# EAGLE design ATEM Tally Shield v1.0 (EAGLE 6.2)
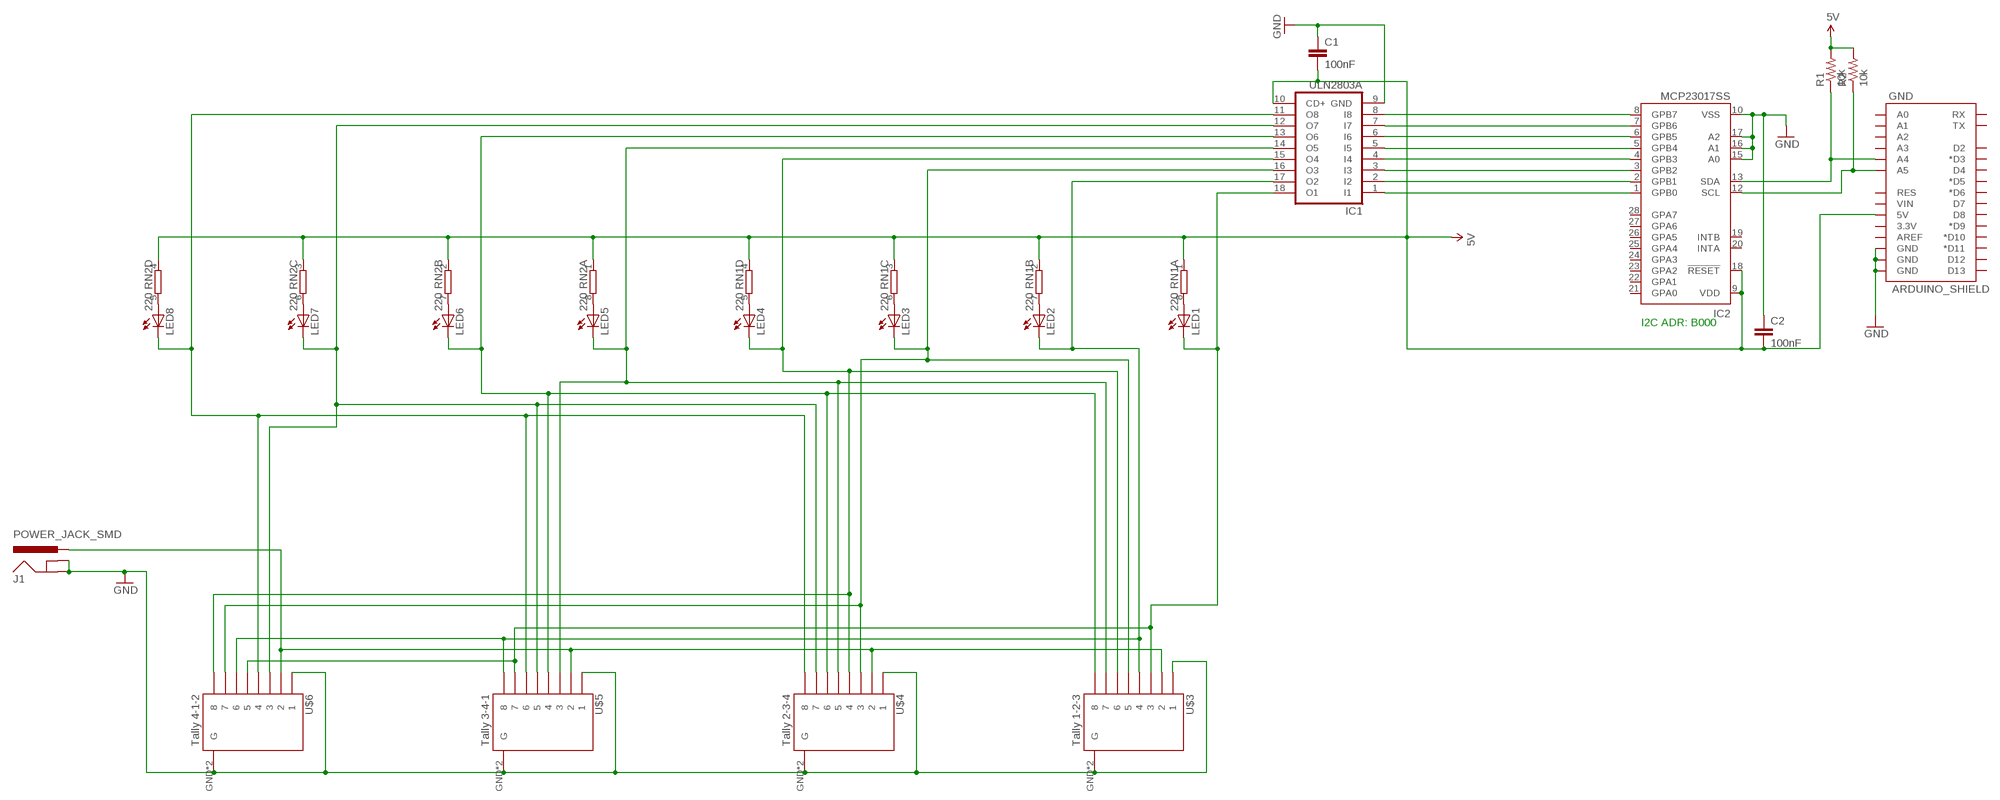
[diagram p0: schematic, sheet 1]

## Parts
C1  100nF  CAP0805  [0805]
C2  100nF  CAP0603-CAP  [0603-CAP]
GND  ARDUINO_SHIELD  [ARDUINO_BOXSHIELD_NOHOLES]
IC1  ULN2803A  ULN2803ASO18W  [SO18W]
IC2  MCP23017SS  [SSOP28]
J1  POWER_JACK_SMD  [POWER_JACK_SMD]
LED1  LEDSML0805  [SML0805]
LED2  LEDSML0805  [SML0805]
LED3  LEDSML0805  [SML0805]
LED4  LEDSML0805  [SML0805]
LED5  LEDSML0805  [SML0805]
LED6  LEDSML0805  [SML0805]
LED7  LEDSML0805  [SML0805]
LED8  LEDSML0805  [SML0805]
R1  10k  RESISTOR0603-RES  [0603-RES]
R2  10k  RESISTOR0603-RES  [0603-RES]
RN1  220  4R-NCAY16  [CAY16_HAND]
RN2  220  4R-NCAY16  [CAY16_HAND]
U$3  Tally 1-2-3  RJ45-8_GND  [RJ45-8_GND]
U$4  Tally 2-3-4  RJ45-8_GND  [RJ45-8_GND]
U$5  Tally 3-4-1  RJ45-8_GND  [RJ45-8_GND]
U$6  Tally 4-1-2  RJ45-8_GND  [RJ45-8_GND]

## Nets
5V [PWR]: C1.2 C2.2 GND.5V@0(5V) IC1.10(CD+) IC2.9(VDD) IC2.18(!RESET) R1.2 R2.2 RN1.1 RN1.2 RN1.3 RN1.4 RN2.1 RN2.2 RN2.3 RN2.4
GND [PWR]: C1.1 C2.1 GND.GND@0(GND) GND.GND@1(GND) GND.GND@4(GND) IC1.9(GND) IC2.10(VSS) IC2.15(A0) IC2.16(A1) IC2.17(A2) J1.GND J1.SHUNT(GNDBREAK) U$3.1 U$3.GND1(G) U$3.GND(G) U$4.1 U$4.GND1(G) U$4.GND(G) U$5.1 U$5.GND1(G) U$5.GND(G) U$6.1 U$6.GND1(G) U$6.GND(G)
N$2: IC1.18(O1) LED1.C U$3.3 U$5.7 U$6.5
N$4: J1.PWR U$3.2 U$4.2 U$5.2 U$6.2
N$5: IC1.1(I1) IC2.1(GPB0)
N$6: IC1.17(O2) LED2.C U$3.4 U$5.8 U$6.6
N$12: IC1.16(O3) LED3.C U$3.5 U$4.3 U$6.7
N$16: IC1.15(O4) LED4.C U$3.6 U$4.4 U$6.8
N$20: IC1.14(O5) LED5.C U$3.7 U$4.5 U$5.3
N$24: IC1.13(O6) LED6.C U$3.8 U$4.6 U$5.4
N$28: IC1.12(O7) LED7.C U$4.7 U$5.5 U$6.3
N$32: IC1.11(O8) LED8.C U$4.8 U$5.6 U$6.4
N$34: IC1.2(I2) IC2.2(GPB1)
N$35: IC1.3(I3) IC2.3(GPB2)
N$36: IC1.4(I4) IC2.4(GPB3)
N$37: IC1.5(I5) IC2.5(GPB4)
N$38: IC1.6(I6) IC2.6(GPB5)
N$39: IC1.7(I7) IC2.7(GPB6)
N$40: IC1.8(I8) IC2.8(GPB7)
N$41: LED1.A RN1.8
N$42: LED2.A RN1.7
N$43: LED3.A RN1.6
N$44: LED4.A RN1.5
N$45: LED5.A RN2.8
N$46: LED6.A RN2.7
N$47: LED7.A RN2.6
N$48: LED8.A RN2.5
N$67: GND.A5 IC2.12(SCL) R2.1
N$74: GND.A4 IC2.13(SDA) R1.1
Unconnected: GND.0(RX) GND.1(TX) GND.2(D2) GND.3(*D3) GND.3.3V GND.4(D4) GND.5(*D5) GND.6(*D6) GND.7(D7) GND.8(D8) GND.9(*D9) GND.10(*D10) GND.11(*D11) GND.12(D12) GND.13(D13) GND.A0 GND.A1 GND.A2 GND.A3 GND.AREF GND.RESET(RES) GND.VIN IC2.19(INTB) IC2.20(INTA) IC2.21(GPA0) IC2.22(GPA1) IC2.23(GPA2) IC2.24(GPA3) IC2.25(GPA4) IC2.26(GPA5) IC2.27(GPA6) IC2.28(GPA7)

## Notes on the sheet
- I2C ADR: B000

## Library data of the parts
C1 C2 = SparkFun:CAP: Capacitor Standard 0603 ceramic capacitor, and 0.1" leaded capacitor.
GND = SKAARHOJ:ARDUINO_SHIELD
IC1 = uln-udn:ULN2803A: DRIVER ARRAY
IC2 = microchip:MCP23017: http://ww1.microchip.com/downloads/en/DeviceDoc/21952a.pdf Source: http://ww1.microchip.com/downloads/en/DeviceDoc/21952a.pdf; MF: MICROCHIP; MPN: MCP23017-E/SS; OC_FARNELL: 1467674; OC_NEWARK: 31K2960
J1 = SKAARHOJ:POWER_JACK_SMD: RASM712PX Right Angle SMT Mount DC Power Jack, pin size 0.100"(2.5mm), with locating post Switchcraft.com
LED1-LED8 = led:LED: LED OSRAM: - CHIPLED LG R971, LG N971, LY N971, LG Q971, LY Q971, LO R971, LY R971 LH N974, LH R974 LS Q976, LO Q976, LY Q976 LO Q996 - Hyper CHIPLED LW Q18S LB Q993, LB Q99A, LB R99A - SideLED LS A670, LO A670, LY A670, LG A670, LP A670 LB A673, LV A673, LT A673, LW A673 LH A674 LY A675 LS A676, LA A676, LO A676, LY A676, LW A676 LS A679, LY A679, LG A679 - Hyper Micro SIDELED® LS Y876, LA Y876, LO Y876, LY Y876 LT Y87S - SmartLED LW L88C, LW L88S LB L89C, LB L89S, LG L890 LS L89K, LO L89K, LY L89K LS L896, LA L896, LO L896, LY L896 - TOPLED LS T670, LO T670, LY T670, LG T670, LP T670 LSG T670, LSP T670, LSY T670, LOP T670, LYG T670 LG T671, LOG T671, LSG T671 LB T673, LV T673, LT T673, LW T673 LH T674 LS T676, LA T676, LO T676, LY T676, LB T676, LH T676, LSB T676, LW T676 LB T67C, LV T67C, LT T67C, LS T67K, LO T67K, LY T67K, LW E67C LS E67B, LA E67B, LO E67B, LY E67B, LB E67C, LV E67C, LT E67C LW T67C LS T679, LY T679, LG T679 LS T770, LO T770, LY T770, LG T770, LP T770 LB T773, LV T773, LT T773, LW T773 LH T774 LS E675, LA E675, LY E675, LS T675 LS T776, LA T776, LO T776, LY T776, LB T776 LHGB T686 LT T68C, LB T68C - Hyper Mini TOPLED® LB M676 - Mini TOPLED Santana® LG M470 LS M47K, LO M47K, LY M47K Source: http://www.osram.convergy.de LUXEON: - LUMILED® LXK2-PW12-R00, LXK2-PW12-S00, LXK2-PW14-U00, LXK2-PW14-V00 LXK2-PM12-R00, LXK2-PM12-S00, LXK2-PM14-U00 LXK2-PE12-Q00, LXK2-PE12-R00, LXK2-PE12-S00, LXK2-PE14-T00, LXK2-PE14-U00 LXK2-PB12-K00, LXK2-PB12-L00, LXK2-PB12-M00, LXK2-PB14-N00, LXK2-PB14-P00, LXK2-PB14-Q00 LXK2-PR12-L00, LXK2-PR12-M00, LXK2-PR14-Q00, LXK2-PR14-R00 LXK2-PD12-Q00, LXK2-PD12-R00, LXK2-PD12-S00 LXK2-PH12-R00, LXK2-PH12-S00 LXK2-PL12-P00, LXK2-PL12-Q00, LXK2-PL12-R00 Source: www.luxeon.com KINGBRIGHT: KA-3528ASYC Source: www.kingbright.com
R1 R2 = SparkFun:RESISTOR: Resistor Basic schematic elements and footprints for 0603, 1206, and PTH resistors.
RN1 RN2 = SKAARHOJ:4R-N: Array Chip Resistor Source: RS Component / Phycomp; OC_FARNELL: unknown; OC_NEWARK: unknown
U$3-U$6 = SKAARHOJ:RJ45-8_GND

## Net classes
0 default: width 0.254 mm
1 PWR: width 0.406 mm, clearance 0.152 mm
2 RELAY LINES: width 0.305 mm, clearance 0.254 mm
3 INput lines: clearance 0.254 mm

## Board
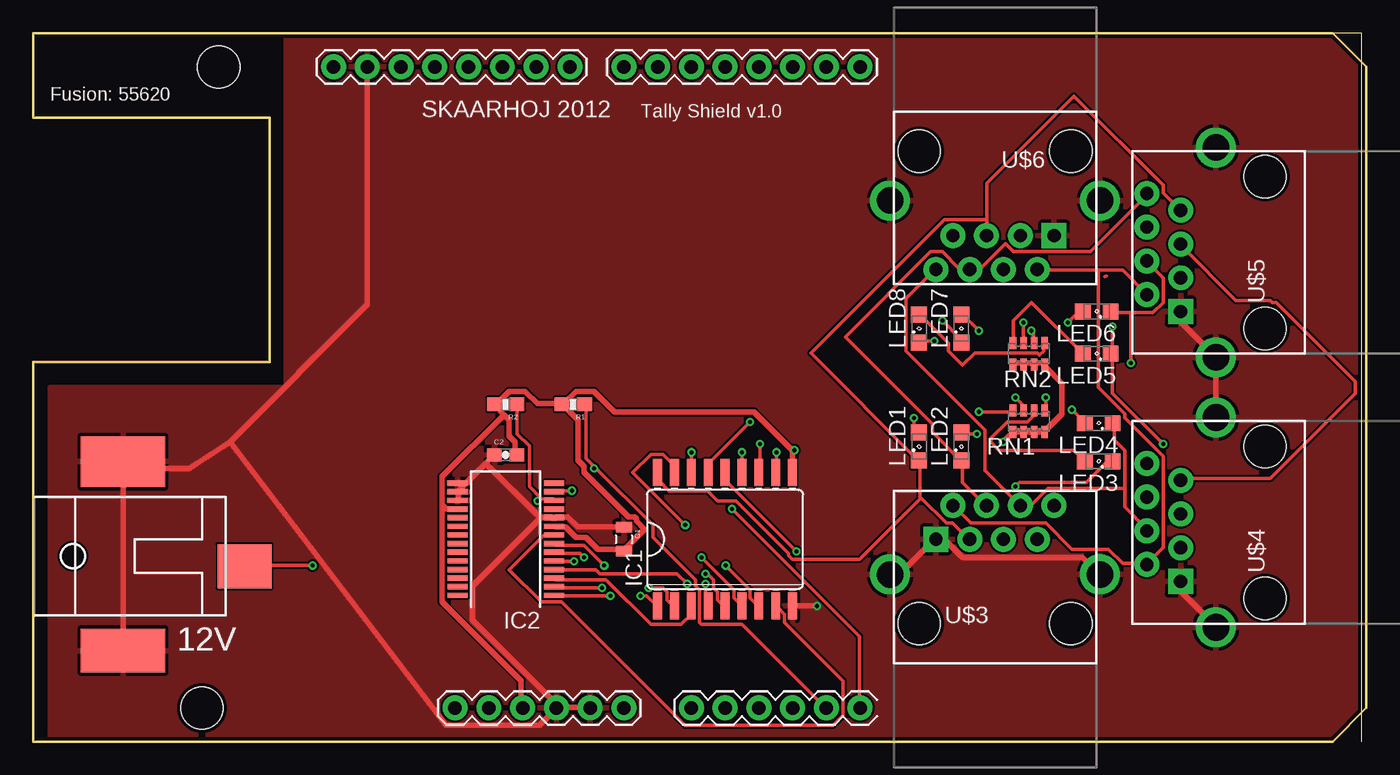
[diagram p1: board, top side]
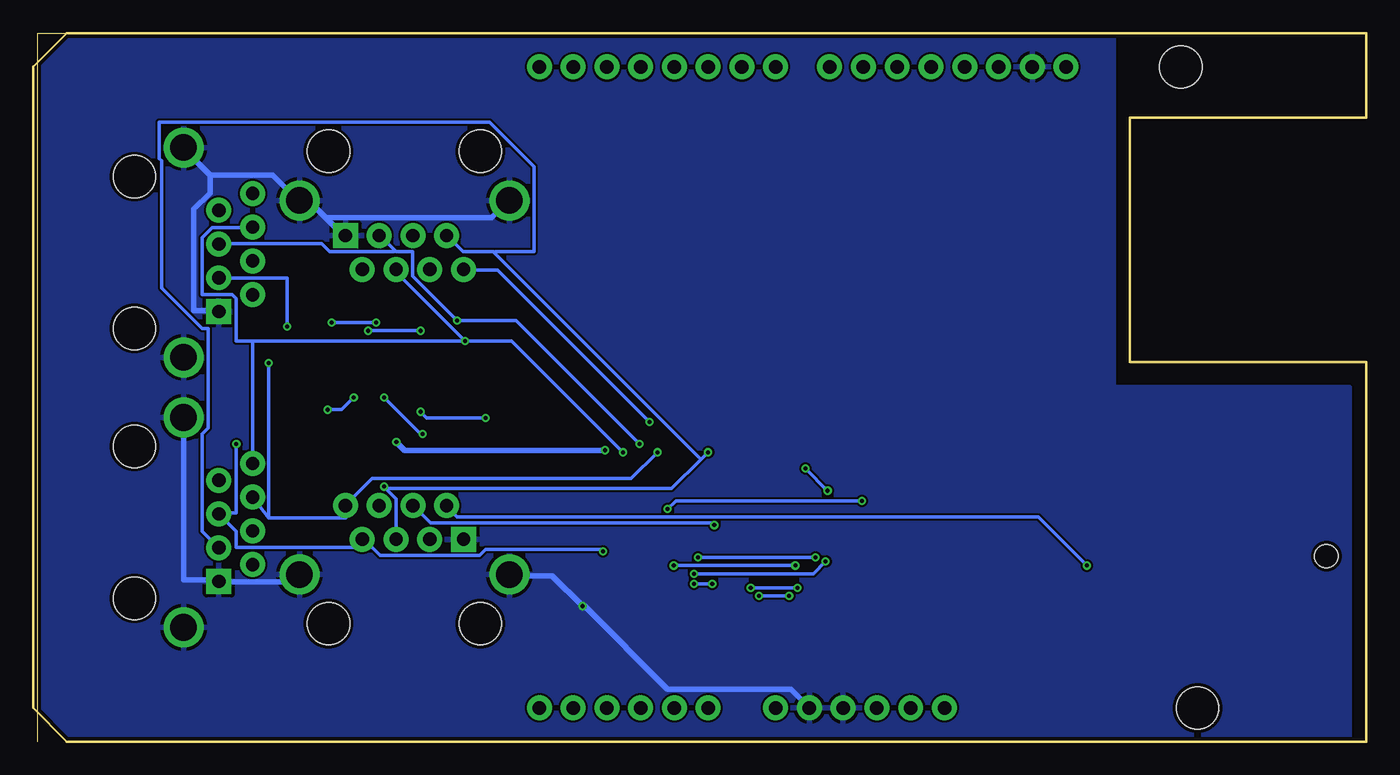
[diagram p2: board, bottom side, seen from below]

Size 100.33 x 53.34 mm. Coordinates in mm from the lower left corner, seen from the top.
Outline: 100,0 100,53.33 0,53.33
Copper layers (1*16): Top 0.035mm / dielectric 1.5mm / Bottom 0.035mm
Design rules: minimum track width 6mil, minimum drill 12mil, track to track 6mil, track to pad 6mil, pad to pad 6mil, via to via 6mil, smd to smd 0mil, copper to edge 10mil, drill to drill 10mil, minimum pad ring 10mil, minimum via ring 6mil, stop-mask expansion 2mil, vias tented up to drill 100mil, thermal gap 10mil

### Footprints (pad centres in the part's own frame; a part is rotated, then mirrored left to right if it is on the bottom)
0805 = smd 0.8 x 1.2: 1 -0.9,0; 2 0.9,0
0603-CAP = smd 1.1 x 1: 1 -0.85,0; 2 0.85,0
ARDUINO_BOXSHIELD_NOHOLES = drill 1.016 pad 1.88: 0 62.23,50.8; 1 59.69,50.8; 2 57.15,50.8; 3 54.61,50.8; 3.3V 34.29,2.54; 4 52.07,50.8; 5 49.53,50.8; 5V@0 36.83,2.54; 6 46.99,50.8; 7 44.45,50.8; 8 40.386,50.8; 9 37.846,50.8; 10 35.306,50.8; 11 32.766,50.8; 12 30.226,50.8; 13 27.686,50.8; A0 49.53,2.54; A1 52.07,2.54; A2 54.61,2.54; A3 57.15,2.54; A4 59.69,2.54; A5 62.23,2.54; AREF 22.606,50.8; GND@0 39.37,2.54; GND@1 41.91,2.54; GND@4 25.146,50.8; RESET 31.75,2.54; VIN 44.45,2.54 | hole 3.2: 13.97,50.8; 12.7,2.54
SO18W = smd 0.66 x 2.032: 1 -5.08,-5.029; 2 -3.81,-5.029; 3 -2.54,-5.029; 4 -1.27,-5.029; 5 0,-5.029; 6 1.27,-5.029; 7 2.54,-5.029; 8 3.81,-5.029; 9 5.08,-5.029; 10 5.08,5.029; 11 3.81,5.029; 12 2.54,5.029; 13 1.27,5.029; 14 0,5.029; 15 -1.27,5.029; 16 -2.54,5.029; 17 -3.81,5.029; 18 -5.08,5.029
SSOP28 = smd 0.4 x 1.5: 1 -4.225,-3.625; 2 -3.575,-3.625; 3 -2.925,-3.625; 4 -2.275,-3.625; 5 -1.625,-3.625; 6 -0.975,-3.625; 7 -0.325,-3.625; 8 0.325,-3.625; 9 0.975,-3.625; 10 1.625,-3.625; 11 2.275,-3.625; 12 2.925,-3.625; 13 3.575,-3.625; 14 4.225,-3.625; 15 4.225,3.625; 16 3.575,3.625; 17 2.925,3.625; 18 2.275,3.625; 19 1.625,3.625; 20 0.975,3.625; 21 0.325,3.625; 22 -0.325,3.625; 23 -0.975,3.625; 24 -1.625,3.625; 25 -2.275,3.625; 26 -2.925,3.625; 27 -3.575,3.625; 28 -4.225,3.625
POWER_JACK_SMD = smd 6.35 x 3.81: GND -6.756,-7.112 | smd 4.064 x 3.302: PWR -15.9,0.762 | smd 6.35 x 3.302: SHUNT -6.756,7.112 | hole 1.778: -2.997,0
SML0805 = smd 1.2 x 1.2: A 1.05,0; C -1.05,0
0603-RES = smd 1.1 x 1: 1 -0.85,0; 2 0.85,0
CAY16_HAND = smd 0.5 x 0.904: 1 -1.2,-0.813; 2 -0.4,-0.813; 3 0.4,-0.813; 4 1.2,-0.813; 5 1.2,0.813; 6 0.4,0.813; 7 -0.4,0.813; 8 -1.2,0.813
RJ45-8_GND = drill 1 pad 1.88 square: 1 -4.445,6.35 | drill 1 pad 1.88: 2 -3.175,8.89; 3 -1.905,6.35; 4 -0.635,8.89; 5 0.635,6.35; 6 1.905,8.89; 7 3.175,6.35; 8 4.445,8.89 | drill 2: GND -7.9,3.7; GND1 7.9,3.7 | hole 3.2: -5.715,0; 5.715,0

### Placement (x,y rotation side)
C1  44.45,15.24 270 top
C2  35.56,21.59 0 top
GND  0,0 0 top
IC1  52.07,15.24 0 top
IC2  35.56,15.24 90 top
J1  0,13.97 180 top
LED1  66.67,22.23 90 top
LED2  69.85,22.23 90 top
LED3  80.19,21.11 180 top
LED4  80.19,23.98 180 top
LED5  80.04,29.21 180 top
LED6  80.04,32.38 180 top
LED7  69.85,31.11 90 top
LED8  66.67,31.11 90 top
R1  40.64,25.4 180 top
R2  35.56,25.4 180 top
RN1  74.93,24.13 0 top
RN2  74.93,29.21 0 top
U$3  72.39,8.89 0 top
U$4  92.71,16.51 90 top
U$5  92.71,36.83 90 top
U$6  72.39,44.45 180 top

### Tracks (layer width: path | path; a pad name or v marks a point on that pad's centre or on a via)
5V  (via drill 0.3)
  Top 0.406: IC2.9 39.32,16.15 40.08,16.15 40.84,15.39 41.6,15.39 42.52,14.48 44.35,14.48 C1.2 44.5,14.48 46.02,16 45.41,16.61 45.41,16.76 45.26,16.92 44.81,16.92 41.45,20.27 41.45,20.73 41,21.18 41,24.23 39.93,25.3 R1.2 | RN2.1 73.76,28.5 74.52,28.5 RN2.2 74.68,28.5 75.29,28.5 RN2.3 75.44,28.5 76.05,28.5 RN2.4 76.2,28.19 77.42,26.98 77.42,24.69 76.2,23.47 RN1.4 RN1.3 RN1.2 RN1.1 73.61,23.16 v73,22.55 | 35.43,24.61 34.75,25.3 R2.2 34.9,25.45 35.81,26.36 37.03,26.36 37.95,25.45 39.78,25.45 R1.2 | 35.43,24.61 35.81,24.23 35.81,23.01 36.27,22.55 36.27,21.64 C2.2 | 30.86,17.75 30.79,17.83 30.79,19.96 35.43,24.61 | 30.86,17.75 31.09,17.53 31.85,17.53 IC2.18 | 57.15,21.95 IC1.10 | 57.15,21.95 54.25,24.84 43.74,24.84 42.22,26.36 40.84,26.36 39.93,25.45 R1.2 | v57.3,21.95 57.15,21.95 | GND.5V@0 36.73,2.59 36.73,4.57 30.79,10.52 30.79,17.68 30.86,17.75
  Bottom 0.406: v73,22.55 72.39,21.95 v57.3,21.95
GND  (via drill 0.3)
  Top 0.406: U$5.1 86.41,32.31 86.41,31.55 89,28.96 U$5.GND 89,28.8 89,24.54 U$4.GND1 | v58.98,10.21 IC1.9 | U$3.GND 64.62,12.65 64.92,12.34 67.82,15.24 U$3.1 68.58,15.24 69.95,13.87 78.94,13.87 80.16,12.65 U$3.GND1 | U$4.1 86.41,12.04 86.41,11.28 89,8.69 U$4.GND | C1.1 44.35,16.15 41,16.15 40.23,16.92 39.32,16.92 IC2.10 39.01,16.92 38.1,16.92 | IC2.17 32,18.29 32,18.75 IC2.16 32,18.9 32.31,19.2 | 32.31,19.2 34.06,20.95 | 34.06,20.95 34.59,21.49 C2.1 | 32.31,19.2 32,19.51 IC2.15 | 34.06,20.95 38.1,16.92 | 6.76,22.1 8.08,22.1 9.6,20.57 | 9.6,20.57 11.73,20.57 14.81,22.58 | 14.81,22.58 31.09,1.22 38.1,1.22 39.32,2.44 GND.GND@0 | GND.GND@1 41.91,2.59 39.47,2.59 GND.GND@0 | GND.GND@4 25.15,32.92 14.81,22.58 | 38.1,16.92 38.1,16.76 33.07,11.73 33.07,9.14 39.47,2.74 GND.GND@0 | 5.18,22.1 6.76,22.1 | 6.76,22.1 J1.GND | 9.6,20.57 6.76,20.57 J1.SHUNT
  Bottom 0.406: 78.26,39.4 79.55,40.69 80.16,40.69 U$6.GND 80.47,40.84 82.3,42.67 87.02,42.67 | 78.26,39.4 76.96,38.1 U$6.1 | U$6.GND1 64.62,40.69 65.84,39.47 78.18,39.47 78.26,39.4 | 87.02,42.67 89,44.65 U$5.GND1 | U$3.GND 64.47,12.5 61.27,12.5 v58.98,10.21 58.83,10.21 52.58,3.96 43.28,3.96 41.91,2.59 GND.GND@1 | U$3.GND1 80.31,12.5 80.77,12.04 86.26,12.04 U$4.1 86.41,12.19 89,12.19 89,24.38 U$4.GND1 | 87.02,42.67 87.02,41.3 88.24,40.08 88.24,32.46 86.41,32.46 U$5.1
  pour Bottom: 19.05,53.34 19.05,26.67 1.27,26.67 1.27,1.27 1.27,0 100.33,0 100.33,53.34
  pour Top: 19.05,53.34 19.05,26.67 1.27,26.67 1.27,1.27 1.27,0 100.33,0 100.33,53.34
N$1
  Top 0.254: 80.77,35.05 80.64,35.03
N$2
  Top 0.254: 71.78,39.32 71.78,42.06 78.33,48.62 85.04,41.91 85.04,41.3 86.26,40.08 U$5.7 | 71.78,39.32 71.78,38.1 U$6.5 | 66.83,18.36 68.73,16.46 69.19,16.46 70.41,15.24 U$3.3 | 66.83,18.36 66.75,18.44 66.75,21.03 LED1.C 66.6,21.18 58.52,29.26 68.58,39.32 71.78,39.32 | 66.83,18.36 62.18,13.72 57.15,13.72 56.84,14.02 56.84,14.17 52.88,18.14 51.51,18.14 50.75,18.9 47.85,18.9 47.09,19.66 47.09,20.27 IC1.18
N$4  (via drill 0.3)
  Top 0.254: 80.16,35.51 81.99,35.51 83.82,33.68 U$5.2 | 80.16,35.51 75.59,35.51 U$6.2 | 83.82,13.41 81.99,13.41 80.92,14.48 78.18,14.48 76.2,16.46 70.56,16.46 69.34,17.68 U$3.2 | 80.16,35.51 80.16,26.67 82.14,24.69 82.14,24.38 85.04,21.49 85.04,14.63 83.82,13.41 | 83.82,13.41 U$4.2 | v21.03,13.26 16,13.26 J1.PWR
  Bottom 0.254: v21.03,13.26 24.69,16.92 68.43,16.92 69.19,17.68 U$3.2
N$5  (via drill 0.3)
  Top 0.254: v43.43,10.97 39.32,10.97 IC2.1 | v45.72,10.97 46.18,10.97 46.94,10.21 IC1.1
  Bottom 0.254: v45.72,10.97 v43.43,10.97
N$6  (via drill 0.3)
  Top 0.254: U$5.8 83.82,41.15 79.55,36.88 73.76,36.88 73.15,37.49 71.32,35.66 70.56,35.66 U$6.6 70.41,35.66 69.65,35.66 68.43,36.88 67.51,36.88 61.11,30.48 67.67,23.93 67.67,23.32 69.8,21.18 LED2.C 69.95,21.03 69.95,19.51 71.63,17.83 U$3.4 | v49.07,16.31 45.11,20.27 46.48,21.64 47.4,21.64 48.16,20.88 48.16,20.27 IC1.17
  Bottom 0.254: v49.07,16.31 49.23,16.46 70.41,16.46 71.63,17.68 U$3.4
N$12  (via drill 0.3)
  Top 0.254: v73.91,19.2 74.22,19.51 79.25,19.51 80.77,21.03 81.23,21.03 LED3.C | v49.53,21.79 IC1.16
  Bottom 0.254: 73.69,18.97 73,18.29 73,15.24 U$3.5 | 73.69,18.97 v73.91,19.2 | 50.06,21.26 52.27,19.05 73.61,19.05 73.69,18.97 | 50.06,21.26 v49.53,21.79 | 50.06,21.26 65.61,36.8 | 65.61,36.8 65.68,36.88 67.97,36.88 69.19,38.1 U$6.7 | U$4.3 86.41,14.63 87.63,15.85 87.63,23.16 87.17,23.62 87.17,31.09 87.63,31.09 90.68,34.14 90.68,43.74 90.83,43.89 90.83,46.63 65.99,46.63 62.64,43.28 62.64,36.88 65.53,36.88 65.61,36.8
N$16  (via drill 0.3)
  Top 0.254: 82.14,19.05 82.14,17.68 83.82,16 U$4.4 | 82.14,19.05 82.14,21.95 81.38,22.71 81.38,23.93 LED4.C | 82.14,19.05 76.35,19.05 75.13,17.83 74.37,17.83 U$3.6 74.22,17.83 71.63,20.42 71.63,23.47 65.68,29.41 65.68,33.38 67.82,35.51 U$6.8 | v53.95,24.08 50.9,21.03 50.9,20.27 IC1.15
  Bottom 0.254: v53.95,24.08 65.38,35.51 67.82,35.51 U$6.8
N$20  (via drill 0.3)
  Top 0.254: v81.23,31.24 81.23,29.26 LED5.C 81.23,29.11 81.23,26.21 v85.04,22.4 | v57.45,14.33 52.12,19.66 52.12,20.27 IC1.14
  Bottom 0.254: v81.23,31.24 81.23,34.9 86.26,34.9 U$5.3 | v57.45,14.33 57.61,14.48 66.29,14.48 66.75,14.02 74.22,14.02 75.44,15.24 U$3.7 74.98,14.63 85.04,14.63 85.04,15.85 86.26,17.07 U$4.5 86.26,17.22 85.04,17.22 v85.04,22.4
N$24  (via drill 0.3)
  Top 0.254: 82.6,32.31 84.28,32.31 85.04,33.07 85.04,34.9 83.82,36.12 U$5.4 | 82.6,32.31 81.23,32.31 LED6.C | v53.34,21.79 IC1.13 | v82.6,28.5 82.6,32.31
  Bottom 0.254: v53.34,21.79 55.32,19.81 74.83,19.81 76.81,17.83 U$3.8 76.81,16.87 82.6,16.87 | 82.6,16.87 83.36,17.83 83.82,18.29 U$4.6 | 82.6,16.87 v82.6,28.5
N$28  (via drill 0.3)
  Top 0.254: U$4.7 86.41,19.81 93.12,19.81 99.52,26.21 99.52,27.13 93.57,33.07 93.27,33.07 93.12,33.22 90.53,33.22 86.41,37.34 U$5.5 | v68.43,31.7 69.8,30.33 69.8,30.18 LED7.C | v54.71,22.4 54.71,20.27 IC1.12
  Bottom 0.254: 73.08,36.96 74.22,38.1 U$6.3 | 73.08,36.96 73,36.88 71.78,36.88 71.78,35.05 v68.43,31.7 64.01,31.7 v54.71,22.4 | U$5.5 86.26,37.49 78.64,37.49 78.03,36.88 73.15,36.88 73.08,36.96
N$32  (via drill 0.3)
  Top 0.254: v67.82,30.18 66.75,30.18 LED8.C | v55.93,21.79 55.93,20.27 IC1.11
  Bottom 0.254: v67.82,30.18 73.15,35.51 U$6.4 | v55.93,21.79 64.31,30.18 v67.82,30.18 | 83.82,30.18 U$4.8 | v67.82,30.18 83.82,30.18 | 83.82,30.18 85.04,30.18 85.04,33.38 85.34,33.68 87.63,33.68 87.63,37.95 86.87,38.71 83.82,38.71 U$5.6
N$34  (via drill 0.3)
  Top 0.254: v42.82,11.58 39.32,11.58 IC2.2 | v46.33,11.58 47.4,11.58 47.7,11.28 47.7,10.67 48.16,10.21 IC1.2
  Bottom 0.254: v46.33,11.58 v42.82,11.58
N$35
  Top 0.254: IC1.3 49.68,10.06 49.68,9.75 48.77,8.84 46.48,8.84 43.13,12.19 39.32,12.19 IC2.3
N$36  (via drill 0.3)
  Top 0.254: v49.23,11.89 48.46,12.65 42.67,12.65 42.37,12.95 39.32,12.95 IC2.4 | v50.6,11.89 50.6,10.36 50.75,10.21 IC1.4
  Bottom 0.254: v50.6,11.89 v49.23,11.89
N$37  (via drill 0.3)
  Top 0.254: v40.69,13.56 39.32,13.56 IC2.5 | v50.6,12.65 50.75,12.65 51.21,12.19 51.21,11.58 51.51,11.28 51.51,10.67 51.97,10.21 IC1.5
  Bottom 0.254: v40.69,13.56 41.6,12.65 v50.6,12.65
N$38  (via drill 0.3)
  Top 0.254: v41.45,13.87 41.15,14.17 39.32,14.17 IC2.6 | v50.29,13.87 52.73,11.43 52.73,10.82 IC1.6
  Bottom 0.254: v50.29,13.87 v41.45,13.87
N$39  (via drill 0.3)
  Top 0.254: v42.98,13.26 41.45,14.78 39.32,14.78 IC2.7 | v52.12,13.26 53.95,11.43 53.95,10.82 54.56,10.21 IC1.7
  Bottom 0.254: v52.12,13.26 v42.98,13.26
N$40
  Top 0.254: IC2.8 39.17,15.54 38.41,15.54 35.81,12.95 38.25,10.52 39.78,10.52 49.07,1.22 60.2,1.22 60.96,1.98 60.96,4.57 56.54,8.99 56.54,9.6 55.93,10.21 IC1.8
N$41  (via drill 0.3)
  Top 0.254: v71.17,24.84 73.61,24.84 RN1.8 | v66.29,24.38 66.29,23.62 66.6,23.32 LED1.A
  Bottom 0.254: v71.17,24.84 70.71,24.38 v66.29,24.38
N$42  (via drill 0.3)
  Top 0.254: v73.91,25.91 74.52,25.3 74.52,24.99 RN1.7 | v71.02,23.16 69.95,23.16 LED2.A
  Bottom 0.254: v73.91,25.91 71.17,23.16 v71.02,23.16
N$43
  Top 0.254: RN1.6 75.29,24.84 75.29,24.54 74.83,24.08 73.3,24.08 72.08,22.86 72.08,22.55 72.69,21.95 78.33,21.95 79.1,21.18 LED3.A
N$44  (via drill 0.3)
  Top 0.254: v76.2,25.91 76.2,24.99 RN1.5 | v78.18,24.99 79.1,24.08 LED4.A
  Bottom 0.254: v76.2,25.91 77.11,24.99 v78.18,24.99
N$45
  Top 0.254: RN2.8 73.76,30.02 73.76,31.7 75.13,33.07 78.94,29.26 LED5.A
N$46  (via drill 0.3)
  Top 0.254: v74.52,31.55 RN2.7 | v77.88,31.55 78.79,32.46 78.94,32.31 LED6.A
  Bottom 0.254: v77.88,31.55 v74.52,31.55
N$47  (via drill 0.3)
  Top 0.254: v75.13,30.94 75.29,30.79 75.29,30.02 RN2.6 | v71.17,30.94 69.95,32.16 LED7.A
  Bottom 0.254: v71.17,30.94 v75.13,30.94
N$48
  Top 0.254: RN2.5 76.05,30.02 76.05,29.41 75.74,29.11 75.59,29.26 70.87,29.26 69.95,28.35 68.89,29.41 68.89,30.02 66.75,32.16 LED8.A
N$67  (via drill 0.3)
  Top 0.254: 38.18,18.36 38.25,18.29 39.17,18.29 IC2.12 | 38.18,18.36 37.34,19.2 37.34,22.25 36.42,23.16 36.42,25.3 R2.1 | v52.58,17.53 62.18,7.92 62.18,2.59 GND.A5 | 38.18,18.36 v37.95,18.14
  Bottom 0.254: v52.58,17.53 51.97,18.14 v37.95,18.14
N$74  (via drill 0.3)
  Top 0.254: 42.29,20.65 46.63,16.31 46.63,15.39 49.84,12.19 49.84,11.73 50.14,11.43 50.14,8.99 50.29,8.84 53.34,8.84 59.59,2.59 GND.A4 | 42.29,20.65 41.6,21.34 41.6,25.3 R1.1 | v40.54,18.9 39.32,18.9 IC2.13 | v42.22,20.57 42.29,20.65
  Bottom 0.254: v42.22,20.57 v40.54,18.9

### Text on the board
_tsilk: Fusion: 55620 | SKAARHOJ 2012 | Tally Shield v1.0 | 12V | 12V